# Altium schematic sheet TSDM_2017.SchDoc: TSDM_2017
size A4; Organization: UBC Formula Electric; Revision: A; SheetNumber: 1; SheetTotal: 1; DocumentName: TSDM_2017; ProjectName: TSDM_2017
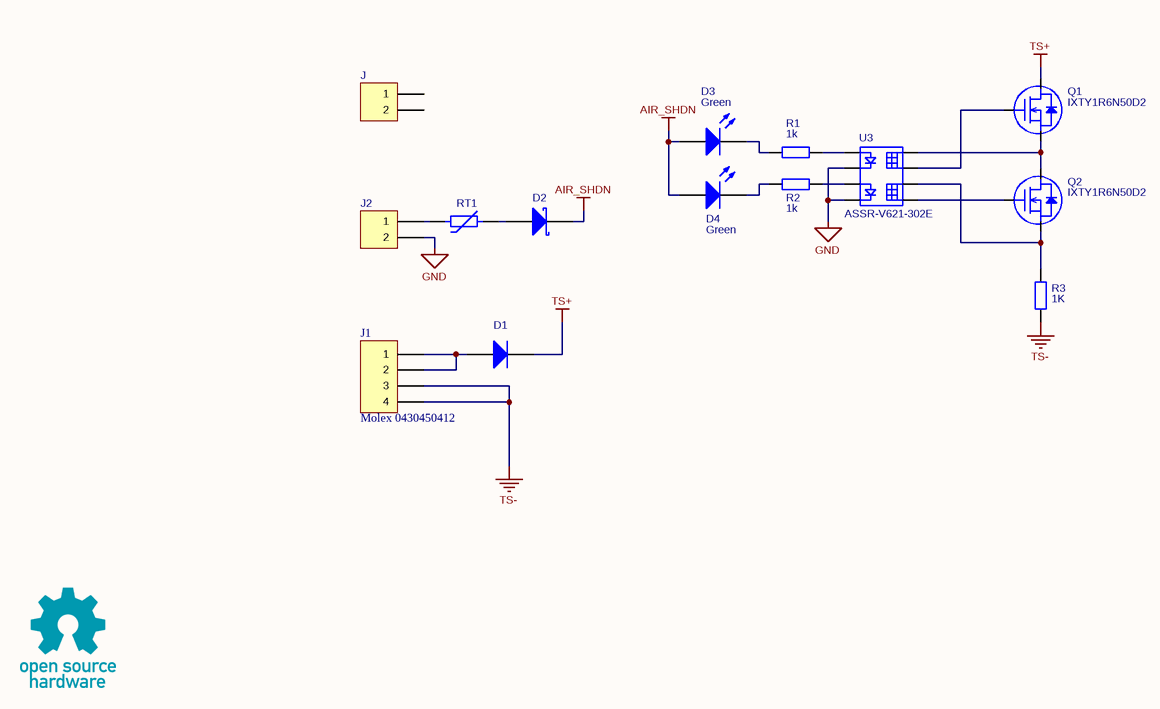
[diagram p0: TSDM_2017.SchDoc]

## Parts
D1  STTH1R06  [STMicroelectronics STTH1R06 (SMA)]  (value not drawn)
D2  D Schottky  [NXP PMEG6020AELRX (SOD-123)]  (value not drawn)
D3  LTST-C193KGKT-5A  [Lite-On LTST-C193K-Series (1608)]  (value not drawn)
D4  LTST-C193KGKT-5A  [Lite-On LTST-C193K-Series (1608)]  (value not drawn)
J  1-770966-0  [TE 1-770966-0]  (value not drawn)
J1  Molex 0430450412  [MOLEX MICRO-FIT 4POS]
J2  (no value)  [TE 2-1445055-2]
Q1  IXTY1R6N50D2  [IXYS IXTY1R6N50D2 (DPAK)]
Q2  IXTY1R6N50D2  [IXYS IXTY1R6N50D2 (DPAK)]
R1  value 1k  [Panasonic ERJ-Series (1608)]
R2  value 1k  [Panasonic ERJ-Series (1608)]
R3  value 1K  [Ohmite TGH-Series (SOT-227)]  (hidden comment: Res2)
RT1  (no value)  [Bel Fuse 0ZCM-Series (1608)]
U3  ASSR-V621-302E  [Avago ASSR-V621-302E (8-SMD)]

## Nets
AIR_SHDN: D2.2(K) D3.1(A) D4.1(A)
GND: J2.2 U3.2(CATHODE) U3.4(CATHODE)
TS+: D1.2(K) Q1.4(DRAIN)
TS-: J1.3 J1.4 R3.2
NetD1_1: D1.1(A) J1.1 J1.2
NetD2_1: D2.1(A) RT1.2
NetD3_2: D3.2(K) R1.2
NetD4_2: D4.2(K) R2.2
NetJ2_1: J2.1 RT1.1
NetQ1_1: Q1.1(GATE) U3.7(OUT-)
NetQ1_3: Q1.3(SOURCE) Q2.4(DRAIN) U3.8(OUT+)
NetQ2_1: Q2.1(GATE) U3.5(OUT-)
NetQ2_3: Q2.3(SOURCE) R3.1 U3.6(OUT+)
NetR1_1: R1.1 U3.1(ANODE)
NetR2_1: R2.1 U3.3(ANODE)

Not connected (* = marked no-connect by the designer): J 1 2

## Notes on the sheet
- (near D3) Green
- (near D4) Green

## Library data of the parts
D1 = Diode: Default Diode; Published: 8-Jun-2000; LatestRevisionDate: 17-Jul-2002; LatestRevisionNote: Re-released for DXP Platform.; PackageVersion: Sep-1996; Publisher: Altium Limited; Supplier 1: Digi-Key; Supplier Part Number 1: 497-3765-1-ND
D2 = D Schottky: Schottky Diode; pin to pad: 1>2 2>1; Published: 8-Jun-2000; LatestRevisionDate: 17-Jul-2002; LatestRevisionNote: Re-released for DXP Platform.; Publisher: Altium Limited; Supplier 1: Digi-Key; Supplier Part Number 1: 1727-2411-1-ND
D3 D4 = LED0: Typical INFRARED GaAs LED; Published: 8-Jun-2000; LatestRevisionDate: 08-Jul-2005; LatestRevisionNote: Mech Layer 1 removed.; PackageReference: LED-0; Publisher: Altium Limited; PackageDescription: LED; 2 Leads; Supplier 1: Digi-Key; Supplier Part Number 1: 160-1828-1-ND
J = TE 1-770966-0: Mini-Universal MATE-N-LOK 2-Pin Female Connector; Supplier 1: Digi-Key; Supplier Part Number 1: A32471-ND
J1 = Molex 0430450412: CONN HEADER VERT 4POS 3MM
J2 = TE 2-1445055-2: Supplier 1: Digi-Key; Supplier Part Number 1: A33207-ND
Q1 Q2 = IXYS IXTY1R6N50D2: 500V Depletion-Mode N-MOSFET; Supplier 1: Digi-Key; Supplier Part Number 1: IXTY1R6N50D2-ND
R1-R3 = Res2: Resistor; Published: 8-Jun-2000; LatestRevisionDate: 17-Jul-2002; LatestRevisionNote: Re-released for DXP Platform.; PackageReference: AXIAL-0.4; Publisher: Altium Limited; PackageDescription: Axial Device, Thru-Hole; 2 Leads; 0.4 in Pin Spacing; Supplier 1: Digi-Key
  R1 R2: Supplier Part Number 1: P1.00KHCT-ND
  R3: Supplier Part Number 1: TGHLV1K00JE-ND
RT1 = Thermistor: Supplier 1: Digi-Key; Supplier Part Number 1: 507-1816-1-ND
U3 = Avago ASSR-V621-302E_1_1: Dual Photovoltaic MOSFET Driver; Supplier 1: Digi-Key; Supplier Part Number 1: 516-3173-5-ND